# EAGLE schematic prototype01 (EAGLE 7.5.0)
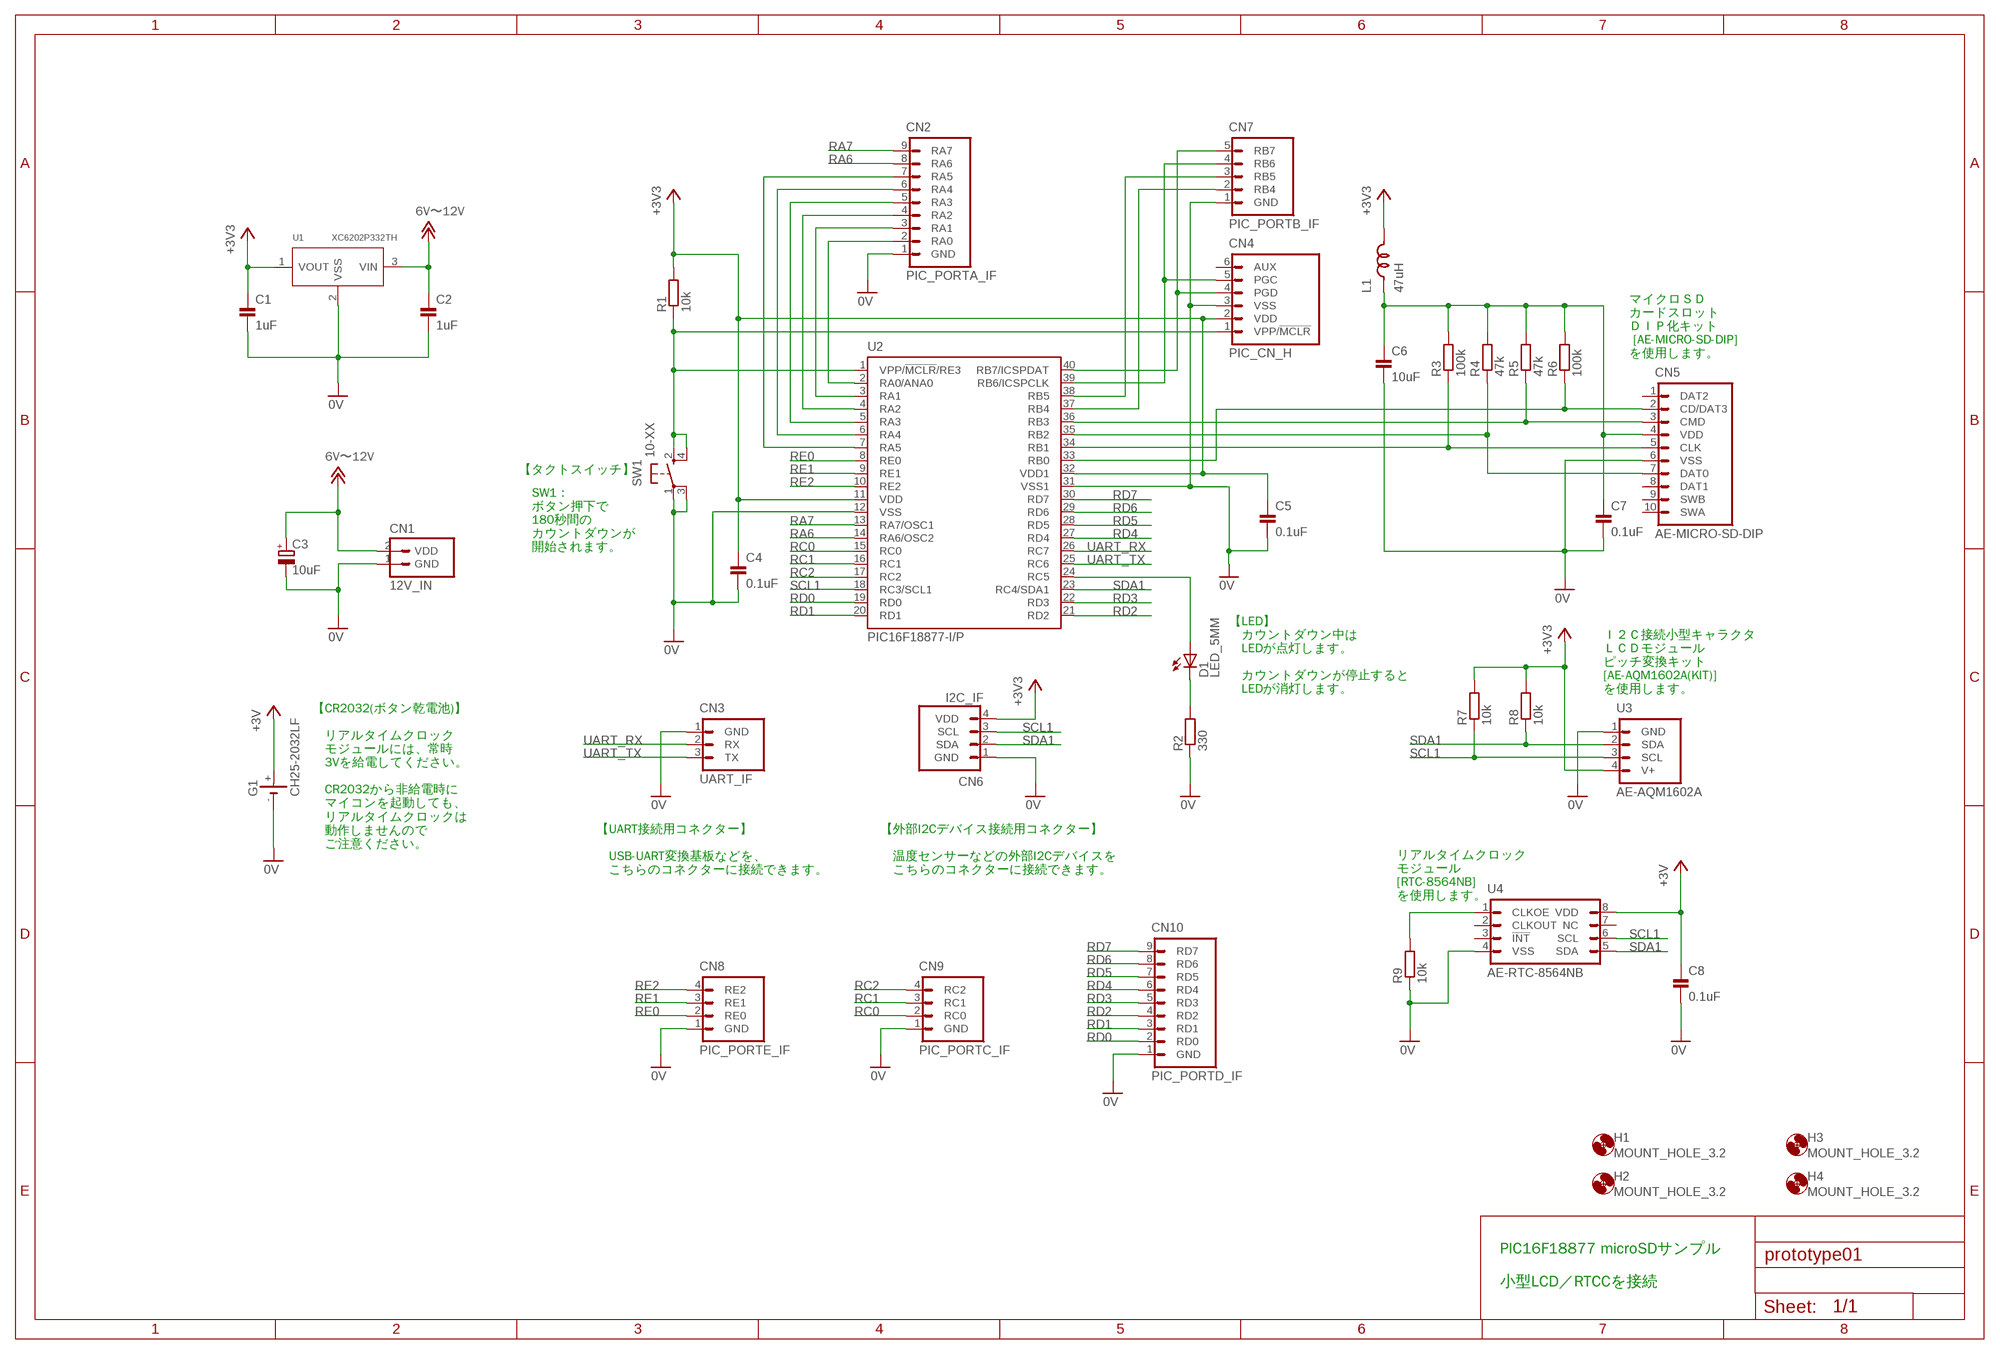
[diagram p0: schematic, sheet 1]

## Parts
C1  1uF  CAP_100MIL  [CAP_100MIL]
C2  1uF  CAP_100MIL  [CAP_100MIL]
C3  10uF  ELECAP_D5_100MIL  [ELECAP_D5_100MIL]
C4  0.1uF  CAP_100MIL  [CAP_100MIL]
C5  0.1uF  CAP_100MIL  [CAP_100MIL]
C6  10uF  CAP_100MIL  [CAP_100MIL]
C7  0.1uF  CAP_100MIL  [CAP_100MIL]
C8  0.1uF  CAP_100MIL  [CAP_100MIL]
CN1  12V_IN  POWER_IF  [HEADER_2PIN_POWER_IF]
CN2  PIC_PORTA_IF  [PIC_PORTA_IF_9PIN]
CN3  UART_IF  [UART_IF_3PIN]
CN4  PIC_CN_H  [HEADER_6PIN]
CN5  AE-MICRO-SD-DIP  [AE-MICRO-SD-DIP]
CN6  I2C_IF  [I2C_IF_4PIN]
CN7  PIC_PORTB_IF  [PIC_PORTB_IF_5PIN]
CN8  PIC_PORTE_IF  [PIC_PORTE_IF_4PIN]
CN9  PIC_PORTC_IF  [PIC_PORTC_IF_4PIN]
CN10  PIC_PORTD_IF  [PIC_PORTD_IF_9PIN]
D1  LED_5MM  [LED5MM]
G1  CH25-2032LF  [CH25-2032LF]
H1  MOUNT_HOLE_3.2  [3,2]
H2  MOUNT_HOLE_3.2  [3,2]
H3  MOUNT_HOLE_3.2  [3,2]
H4  MOUNT_HOLE_3.2  [3,2]
L1  47uH  LEAD_INDUCTOR  [INDUCTOR_0207_300MIL]
R1  10k  RESISTOR_200MIL  [RESISTOR_0204_200MIL]
R2  330  RESISTOR_200MIL  [RESISTOR_0204_200MIL]
R3  100k  RESISTOR_200MIL  [RESISTOR_0204_200MIL]
R4  47k  RESISTOR_200MIL  [RESISTOR_0204_200MIL]
R5  47k  RESISTOR_200MIL  [RESISTOR_0204_200MIL]
R6  100k  RESISTOR_200MIL  [RESISTOR_0204_200MIL]
R7  10k  RESISTOR_200MIL  [RESISTOR_0204_200MIL]
R8  10k  RESISTOR_200MIL  [RESISTOR_0204_200MIL]
R9  10k  RESISTOR_200MIL  [RESISTOR_0204_200MIL]
SW1  10-XX  [B3F-10XX]
U1  XC6202P332TH  [TO92-LINE]
U2  PIC16F18877-I/P  [DIL40]
U3  AE-AQM1602A  [AE-AQM1602A]
U4  AE-RTC-8564NB  [DIL8_AE-RTC-8564NB]

## Nets
0V: C1.2 C2.2 C3.- C4.2 C5.2 C6.2 C7.2 C8.2 CN1.1(GND) CN2.1(GND) CN3.1(GND) CN4.3(VSS) CN5.6(VSS) CN6.1(GND) CN7.1(GND) CN8.1(GND) CN9.1(GND) CN10.1(GND) G1.- R2.1 R9.1 SW1.1(P) SW1.3(P1) U1.2(VSS) U2.12(VSS) U2.31(VSS1) U3.1(GND) U4.4(VSS)
+3V: C8.1 G1.+ U4.8(VDD)
+3V3: C1.1 C4.1 C5.1 CN4.2(VDD) CN6.4(VDD) L1.2 R1.2 R7.2 R8.2 U1.1(VOUT) U2.11(VDD) U2.32(VDD1) U3.4(V+)
+12V: C2.1 C3.+ CN1.2(VDD) U1.3(VIN) ; supply symbol labelled 6V〜12V
N$1: D1.K(C) R2.2
N$2: CN4.4(PGD) CN7.5(RB7) U2.40(RB7/ICSPDAT)
N$3: CN4.1(VPP/!MCLR) R1.1 SW1.2(S) SW1.4(S1) U2.1(VPP/!MCLR!/RE3)
N$4: CN4.5(PGC) CN7.4(RB6) U2.39(RB6/ICSPCLK)
N$5: D1.A U2.24(RC5)
N$6: CN5.5(CLK) R3.1 U2.34(RB1)
N$7: CN5.2(CD/DAT3) R6.1 U2.33(RB0)
N$8: CN5.7(DAT0) R4.1 U2.35(RB2)
N$9: C6.1 C7.1 CN5.4(VDD) L1.1 R3.2 R4.2 R5.2 R6.2
N$10: CN2.2(RA0) U2.2(RA0/ANA0)
N$11: CN2.3(RA1) U2.3(RA1)
N$12: CN5.3(CMD) R5.1 U2.36(RB3)
N$13: CN2.4(RA2) U2.4(RA2)
N$14: CN2.5(RA3) U2.5(RA3)
N$15: CN2.6(RA4) U2.6(RA4)
N$16: R9.2 U4.1(CLKOE)
N$17: CN2.7(RA5) U2.7(RA5)
N$18: CN7.2(RB4) U2.37(RB4)
N$19: CN7.3(RB5) U2.38(RB5)
RA6: CN2.8(RA6) U2.14(RA6/OSC2)
RA7: CN2.9(RA7) U2.13(RA7/OSC1)
RC0: CN9.2(RC0) U2.15(RC0)
RC1: CN9.3(RC1) U2.16(RC1)
RC2: CN9.4(RC2) U2.17(RC2)
RD0: CN10.2(RD0) U2.19(RD0)
RD1: CN10.3(RD1) U2.20(RD1)
RD2: CN10.4(RD2) U2.21(RD2)
RD3: CN10.5(RD3) U2.22(RD3)
RD4: CN10.6(RD4) U2.27(RD4)
RD5: CN10.7(RD5) U2.28(RD5)
RD6: CN10.8(RD6) U2.29(RD6)
RD7: CN10.9(RD7) U2.30(RD7)
RE0: CN8.2(RE0) U2.8(RE0)
RE1: CN8.3(RE1) U2.9(RE1)
RE2: CN8.4(RE2) U2.10(RE2)
SCL1: CN6.3(SCL) R7.1 U2.18(RC3/SCL1) U3.3(SCL) U4.6(SCL)
SDA1: CN6.2(SDA) R8.1 U2.23(RC4/SDA1) U3.2(SDA) U4.5(SDA)
UART_RX: CN3.2(RX) U2.26(RC7)
UART_TX: CN3.3(TX) U2.25(RC6)
Unconnected: CN4.6(AUX) CN5.1(DAT2) CN5.8(DAT1) CN5.9(SWB) CN5.10(SWA) U4.2(CLKOUT) U4.3(!INT!) U4.7(NC)

## Notes on the sheet
- マイクロＳＤ
  カードスロット
  ＤＩＰ化キット
   [AE-MICRO-SD-DIP]
  を使用します。
- 【タクトスイッチ】
- SW1：
  ボタン押下で
  180秒間の
  カウントダウンが
  開始されます。
- 【LED】
  　カウントダウン中は
  　LEDが点灯します。
  
  　カウントダウンが停止すると
  　LEDが消灯します。
- Ｉ２Ｃ接続小型キャラクタ
  ＬＣＤモジュール
  ピッチ変換キット
  [AE-AQM1602A(KIT)]
  を使用します。
- 【CR2032(ボタン乾電池)】
  
  　リアルタイムクロック
  　モジュールには、常時
  　3Vを給電してください。
  
  　CR2032から非給電時に
  　マイコンを起動しても、
  　リアルタイムクロックは
  　動作しませんので
  　ご注意ください。
- 【UART接続用コネクター】
  
  　USB-UART変換基板などを、
  　こちらのコネクターに接続できます。
- 【外部I2Cデバイス接続用コネクター】
  
  　温度センサーなどの外部I2Cデバイスを
  　こちらのコネクターに接続できます。
- リアルタイムクロック
  モジュール
  [RTC-8564NB]
  を使用します。
- PIC16F18877 microSDサンプル
  
  小型LCD／RTCCを接続

## Library data of the parts
C1 C2 C4-C8 = Parts:CAP: コンデンサー
C3 = Parts:ELECAP: 電解コンデンサー
CN1 = PartsForProto:POWER_IF: 電源供給インターフェース
CN2 = PartsForProto:PIC_PORTA_IF: PIC GPIO インターフェース
CN3 = PartsForProto:UART_IF: UART インターフェース
CN4 = Connectors:PIC_CN: PICKit 3 インターフェースピン
CN5 = PartsForProto:AE-MICRO-SD-DIP: マイクロＳＤカードスロットＤＩＰ化キット ヒロセ電機のｍｉｃｒｏＳＤカードスロットを ブレッドボードやユニバーサル基板に 取り付けられるようにするセットです。
CN6 = PartsForProto:I2C_IF: I2C インターフェース
CN7 = PartsForProto:PIC_PORTB_IF: PIC GPIO インターフェース
CN8 = PartsForProto:PIC_PORTE_IF: PIC GPIO インターフェース
CN9 = PartsForProto:PIC_PORTC_IF: PIC GPIO インターフェース
CN10 = PartsForProto:PIC_PORTD_IF: PIC GPIO インターフェース
D1 = Parts:LED: 発光ダイオード
G1 = Parts:CH25-2032LF: ボタン電池基板取付用ホルダー ＣＲ２０３２リチウム電池用のホルダーです。 ■サイズ：２９ｘ２３ｍｍ ■高さ：基板高約８．５ｍｍ（電池入れると約１０ｍｍ） ■＋足と－足の間隔：２０ｍｍ
H1-H4 = Generic:MOUNT_HOLE
L1 = Parts:LEAD_INDUCTOR: LEAD INDUCTOR
R1-R9 = Parts:RESISTOR: 抵抗器
SW1 = Parts:10-XX: TACT SWITCH
U1 = Parts:XC6202*: 低損失ＣＭＯＳ三端子レギュレーター ・定格出力：５Ｖ ・最大出力電流：１５０ｍＡ以上 ・入力最大電圧：２０Ｖ ・入出力電圧差： ０．２Ｖ（３０ｍＡ時） ０．６７Ｖ（１００ｍＡ時） ・低消費電流：１０μＡ
U2 = Parts:PIC16F18877*: Full-Featured 44-Pin Microcontrollers ・プログラムメモリ：３２７６８ワード ・ＥＥＰＲＯＭ：２５６バイト ・データＳＲＡＭ：４０９６バイト ・Ｉ／Ｏ：最大３６ ・動作クロック：３２ＭＨｚ（最大） ・電源電圧：２．３Ｖ～５．５Ｖ ・４０ピンＤＩＰパッケージ
U3 = PartsForProto:AE-AQM1602A: LCDモジュール ピッチ変換キット Ｉ２Ｃ接続小型キャラクタＬＣＤモジュール AE-AQM1602A ◆６６ｍｍ×２７．７ｍｍ２．０ｍｍ （画面５４．７ｍｍｘ１０．８ｍｍ） ◆電源電圧は３．１～５．５Ｖ ◆低消費電流です：１ｍＡ＠３．３Ｖ
U4 = PartsForProto:AE-RTC-8564NB: リアルタイムクロック（ＲＴＣ）モジュール 宮崎エプソン（セイコーエプソン・エプソントヨコム）の リアルタイムクロックＩＣ（ＲＴＣ－８５６４ＮＢ）を 使ったクロックモジュールです。 秋月電子通商 <http://akizukidenshi.com/catalog/g/gI-00233/>